# Altium schematic sheet 04_SODIMM connector 1_3.SchDoc: C200
size 594 x 420 mm; Page Create Date: March  8, 1995; Page Number: 4; Page Size: A2; Comment: radxa_1010; Page Count: 21; RevCode: V1.11; Doc: 04_SODIMM connector 1_3; DsnPath: D:\WMS\C200\CC122\对外\C200 V1.11.DSN; SchematicName: c200; PageName: 04_SODIMM connector 1_3; PageSize: A2; TopSchematic: True
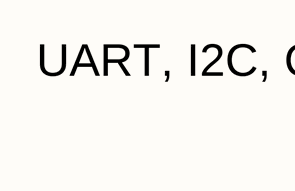
[diagram p0: 04_SODIMM connector 1_3.SchDoc, top left]
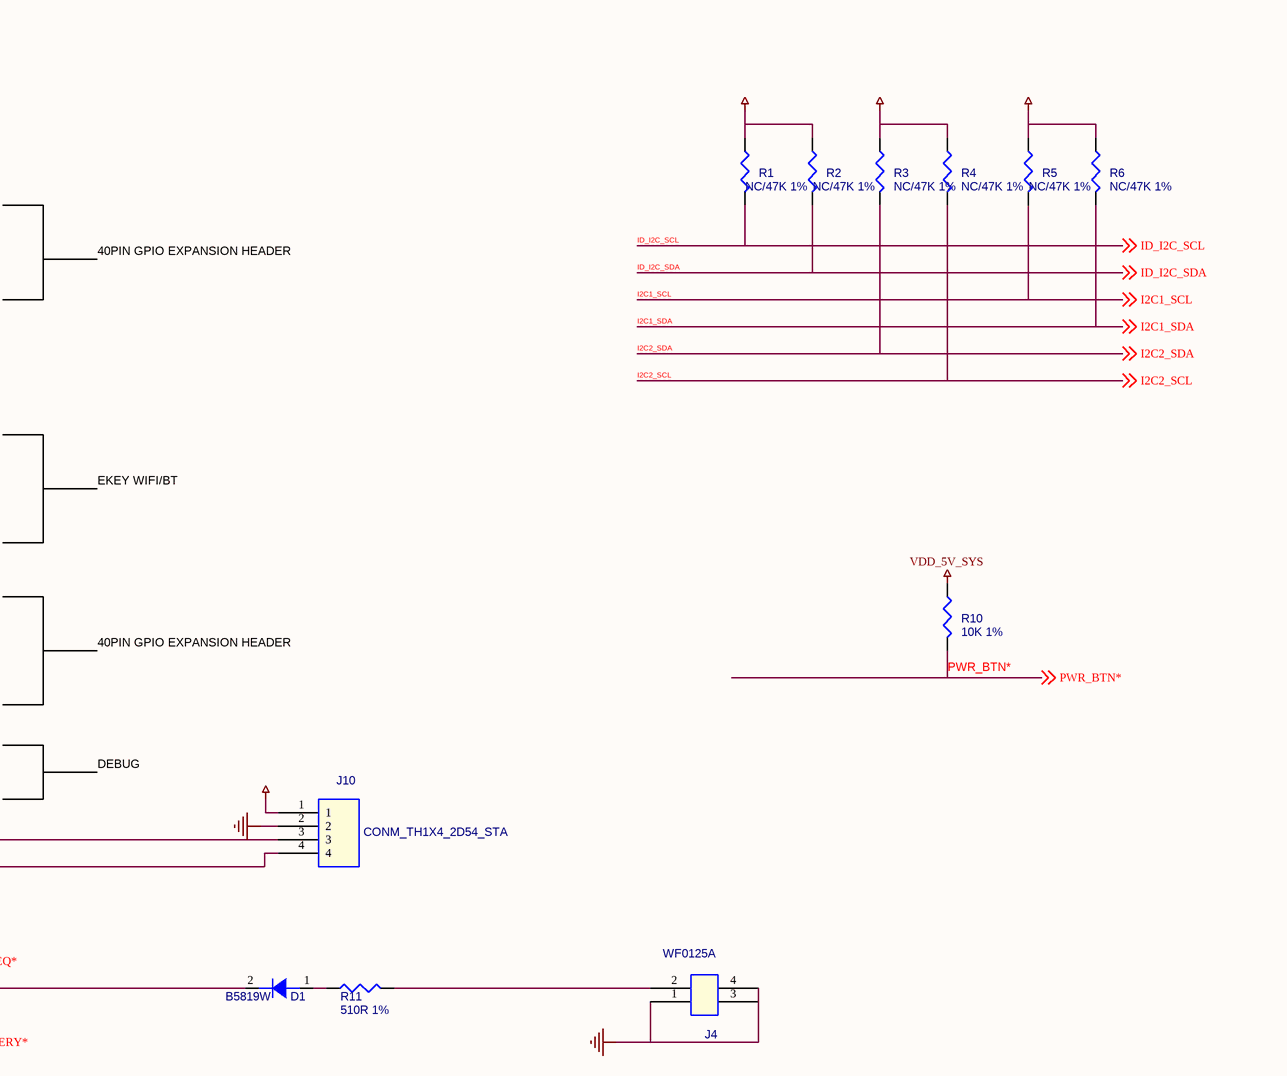
[diagram p1: 04_SODIMM connector 1_3.SchDoc, top right]
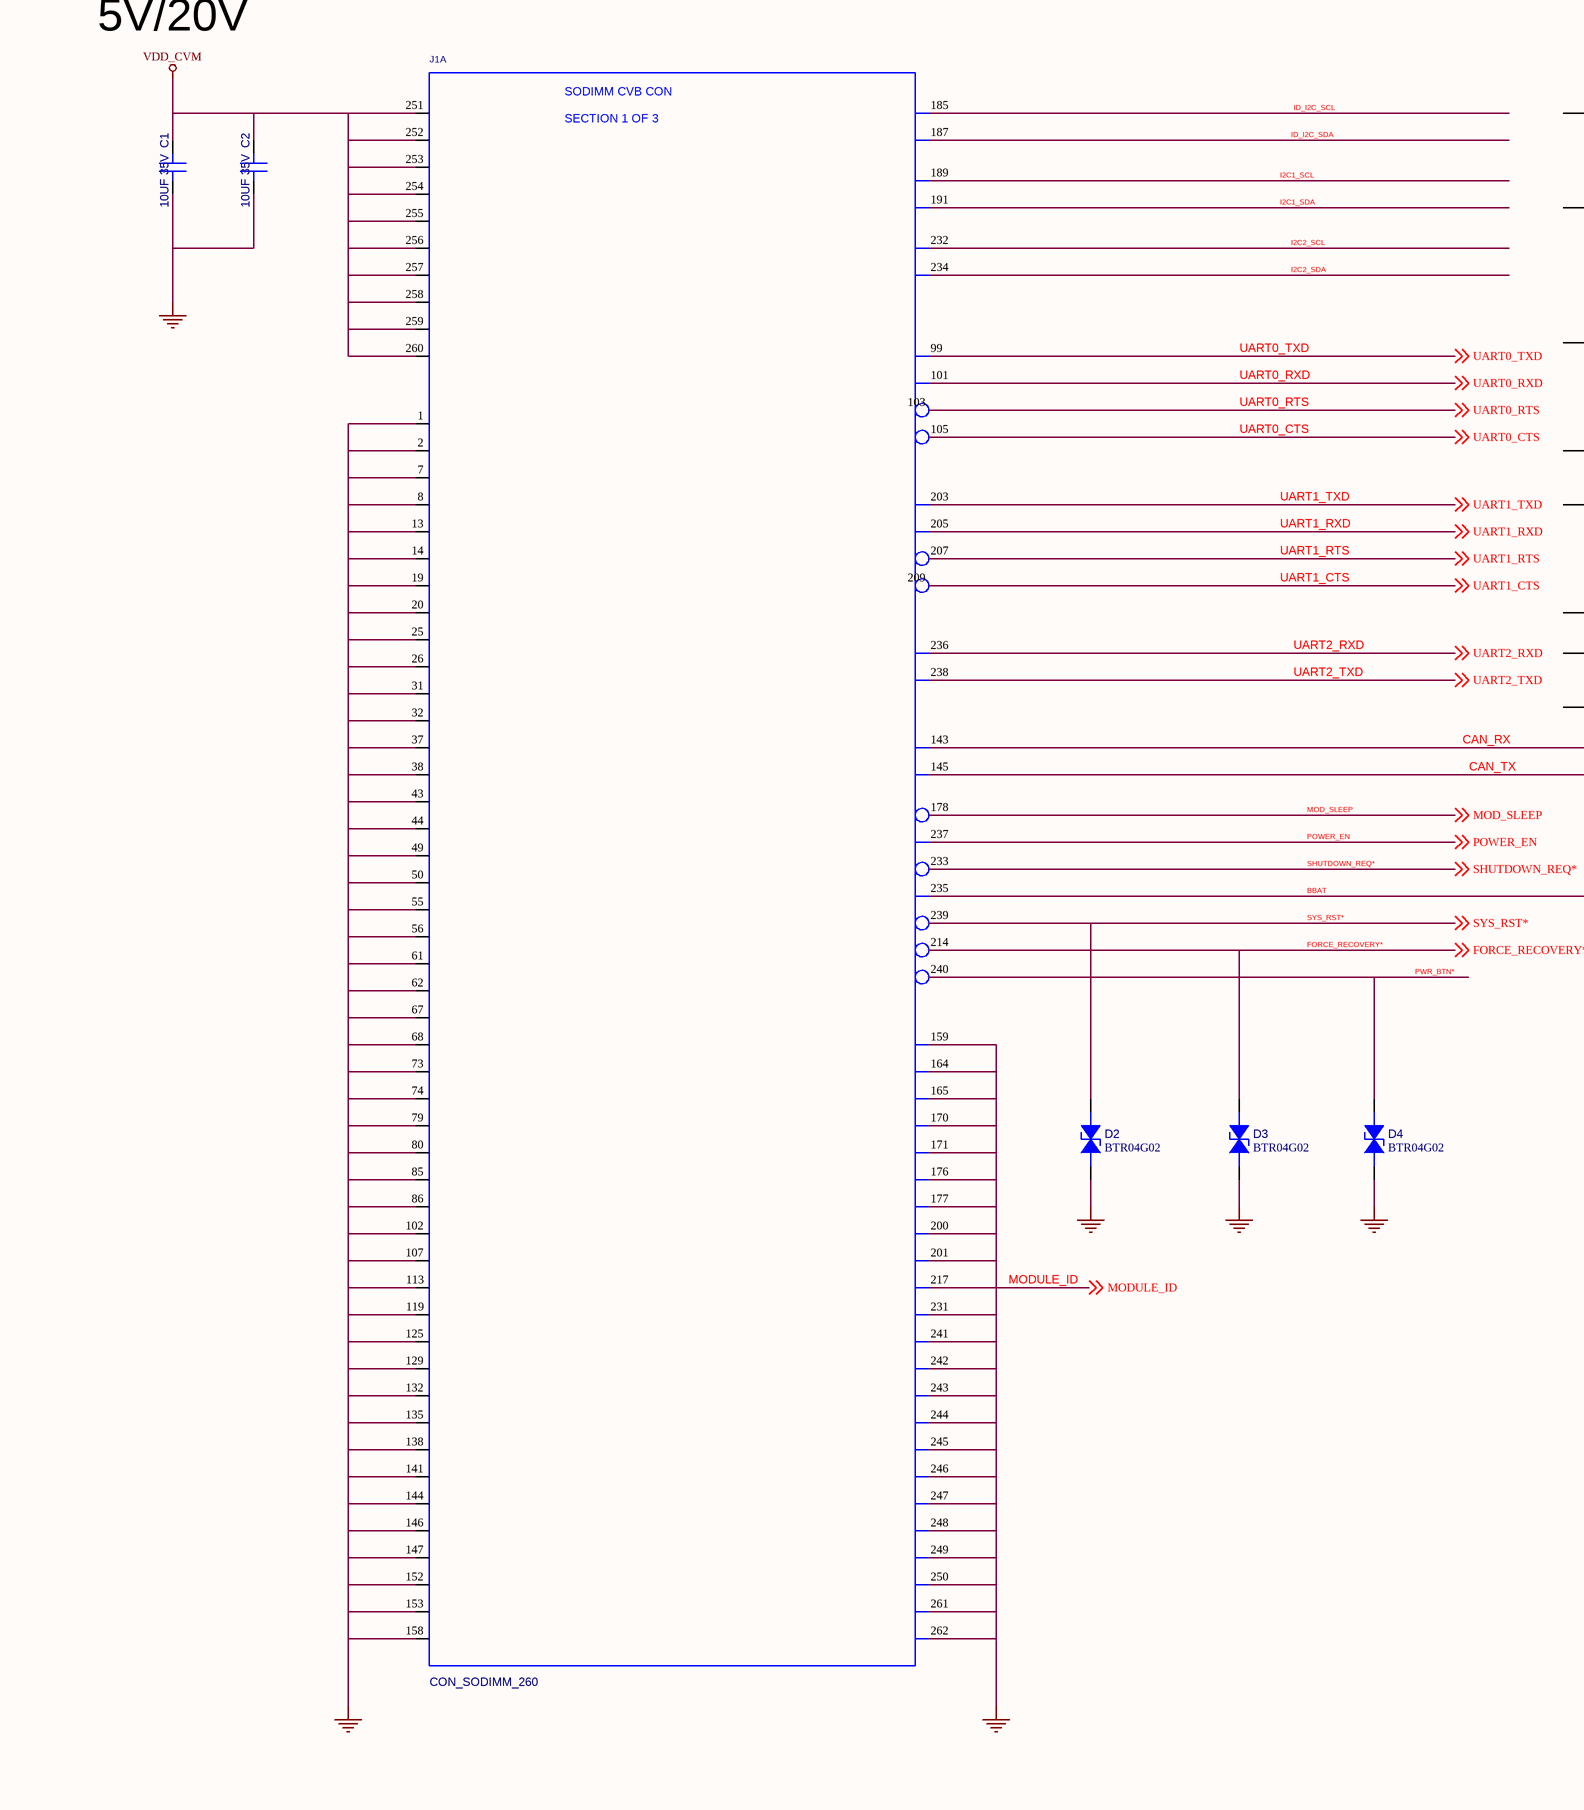
[diagram p2: 04_SODIMM connector 1_3.SchDoc, bottom left]
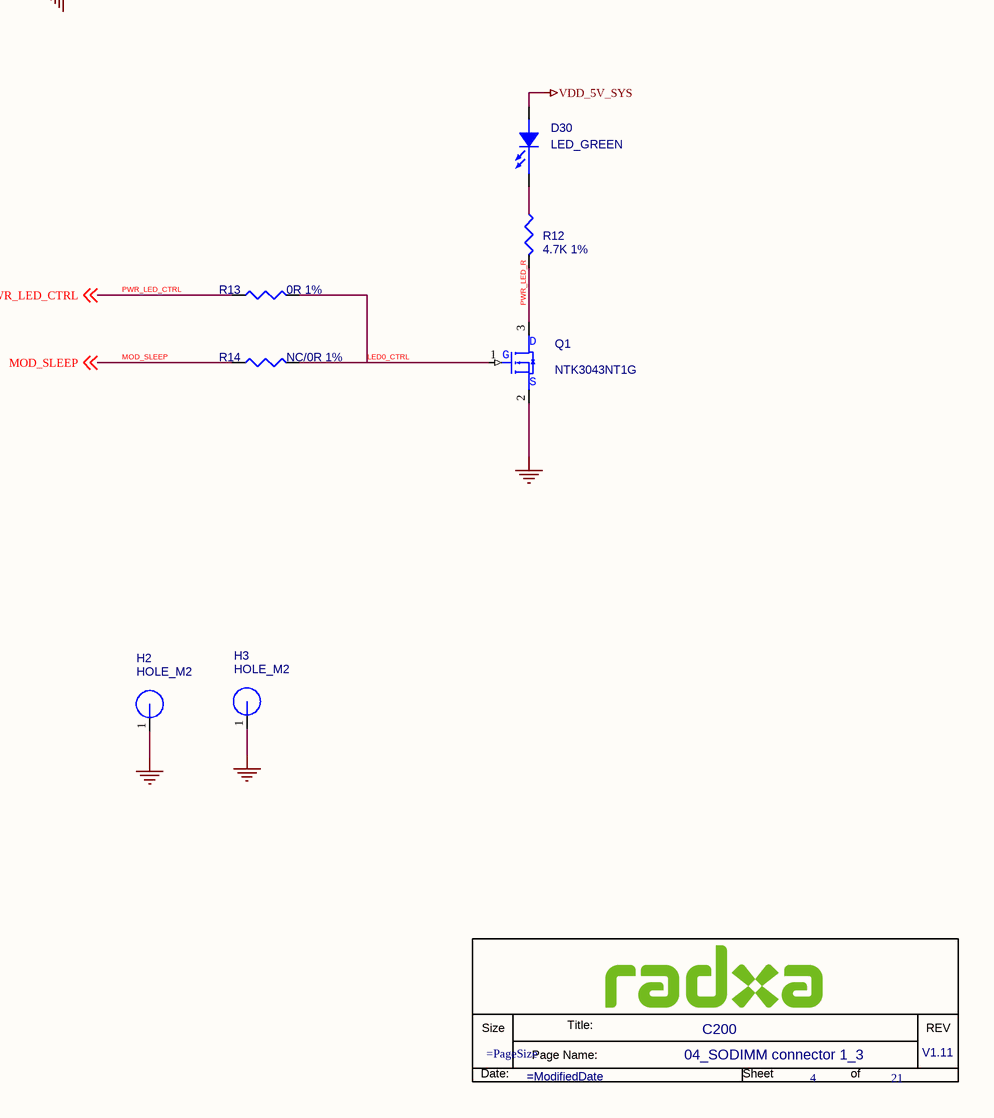
[diagram p3: 04_SODIMM connector 1_3.SchDoc, bottom right]

## Parts
*  Doc: 04_SODIMM connector 1_3  RevCode: V1.11  Title: C200  Page Number: 4  Page Count: 21  (hidden comment: radxa_1010)  (graphical)
C1  10UF 35V  [C1206]
C2  10UF 35V  [C1206]
D1  B5819W  [SOD_123]
D2  BTR04G02  [DFN1006-2L]
D3  BTR04G02  [DFN1006-2L]
D4  BTR04G02  [DFN1006-2L]
D30  LED_GREEN  [LED_D0603]
H2  HOLE_M2  [H3.8MM]
H3  HOLE_M2  [H3.8MM]
J1  CON_SODIMM_260  [SODIMM_SM260_0D5_78D0X26D1]  (part A of 3)
J4  WF0125A  [CON_SM1X2_1D25_LIE]
J10  CONM_TH1X4_2D54_STA  [CONM_TH1X4_2D54_STA]
Q1  NTK3043NT1G  [SOT_723]
R1  NC/47K 1%  [R0402]
R2  NC/47K 1%  [R0402]
R3  NC/47K 1%  [R0402]
R4  NC/47K 1%  [R0402]
R5  NC/47K 1%  [R0402]
R6  NC/47K 1%  [R0402]
R10  10K 1%  [R0402]
R11  510R 1%  [R0402]
R12  4.7K 1%  [R0402]
R13  0R 1%  [R0402]
R14  NC/0R 1%  [R0402]

## Nets
GND: C1.2(B) C2.2(B) D2.1(ANODE) D3.1(ANODE) D4.1(ANODE) H2.1 H3.1 J1.1(GND1) J1.2(GND2) J1.7(GND3) J1.8(GND4) J1.13(GND5) J1.14(GND6) J1.19(GND7) J1.20(GND8) J1.25(GND9) J1.26(GND10) J1.31(GND11) J1.32(GND12) J1.37(GND13) J1.38(GND14) J1.43(GND15) J1.44(GND16) J1.49(GND17) J1.50(GND18) J1.55(GND19) J1.56(GND20) J1.61(GND21) J1.62(GND22) J1.67(GND23) J1.68(GND24) J1.73(GND25) J1.74(GND26) J1.79(GND27) J1.80(GND28) J1.85(GND29) J1.86(GND30) J1.102(GND31) J1.107(GND32) J1.113(GND33) J1.119(GND34) J1.125(GND35) J1.129(GND36) J1.132(GND37) J1.135(GND38) J1.138(GND39) J1.141(GND40) J1.144(GND41) J1.146(GND42) J1.147(GND43) J1.152(GND44) J1.153(GND45) J1.158(GND46) J1.159(GND47) J1.164(GND48) J1.165(GND49) J1.170(GND50) J1.171(GND51) J1.176(GND52) J1.177(GND53) J1.200(GND54) J1.201(GND55) J1.231(GND57) J1.241(GND58) J1.242(GND59) J1.243(GND60) J1.244(GND61) J1.245(GND62) J1.246(GND63) J1.247(GND64) J1.248(GND65) J1.249(GND66) J1.250(GND67) J1.261(MNT1) J1.262(MNT2) J4.1 J4.3 J4.4 J10.2 Q1.2(S)
VDD_1V8: R3.1 R4.1
VDD_3V3_SYS: J10.1 R1.1 R2.1 R5.1 R6.1
VDD_5V_SYS: D30.1(ANODE) R10.1
VDD_CVM: C1.1(A) C2.1(A) J1.251(VDD_IN1) J1.252(VDD_IN2) J1.253(VDD_IN3) J1.254(VDD_IN4) J1.255(VDD_IN5) J1.256(VDD_IN6) J1.257(VDD_IN7) J1.258(VDD_IN8) J1.259(VDD_IN9) J1.260(VDD_IN10)
BBAT: D1.2(K) J1.235(PMIC_BBAT)
CAN_RX: J1.143(CAN_RX) J10.3
CAN_TX: J1.145(CAN_TX) J10.4
FORCE_RECOVERY*: D3.2(CATHODE) J1.214(FORCE_RECOVERY*) ; off-sheet FORCE_RECOVERY*
I2C1_SCL: J1.189(GEN2_I2C_SCL) R5.2 ; off-sheet I2C1_SCL
I2C1_SDA: J1.191(GEN2_I2C_SDA) R6.2 ; off-sheet I2C1_SDA
I2C2_SCL: J1.232(GEN3_I2C_SCL) R4.2 ; off-sheet I2C2_SCL
I2C2_SDA: J1.234(GEN3_I2C_SDA) R3.2 ; off-sheet I2C2_SDA
ID_I2C_SCL: J1.185(GEN1_I2C_SCL) R1.2 ; off-sheet ID_I2C_SCL
ID_I2C_SDA: J1.187(GEN1_I2C_SDA) R2.2 ; off-sheet ID_I2C_SDA
LED0_CTRL: Q1.1(G) R13.2 R14.2
MOD_SLEEP: J1.178(GPIO_PA6) R14.1 ; off-sheet MOD_SLEEP
MODULE_ID: J1.217(GND56) ; off-sheet MODULE_ID
POWER_EN: J1.237(POWER_EN) ; off-sheet POWER_EN
PWR_BTN*: D4.2(CATHODE) J1.240(BUTTON_PWR_ON*) R10.2 ; off-sheet PWR_BTN*
PWR_LED_CTRL: R13.1 ; off-sheet PWR_LED_CTRL
PWR_LED_R: Q1.3(D) R12.2
SHUTDOWN_REQ*: J1.233(SHUTDOWN_REQ*) ; off-sheet SHUTDOWN_REQ*
SYS_RST*: D2.2(CATHODE) J1.239(SYS_RESET_IN*) ; off-sheet SYS_RST*
UART0_CTS: J1.105(UART3_CTS) ; off-sheet UART0_CTS
UART0_RTS: J1.103(UART3_RTS) ; off-sheet UART0_RTS
UART0_RXD: J1.101(UART3_RXD) ; off-sheet UART0_RXD
UART0_TXD: J1.99(UART3_TXD) ; off-sheet UART0_TXD
UART1_CTS: J1.209(UART2_CTS) ; off-sheet UART1_CTS
UART1_RTS: J1.207(UART2_RTS) ; off-sheet UART1_RTS
UART1_RXD: J1.205(UART2_RXD) ; off-sheet UART1_RXD
UART1_TXD: J1.203(UART2_TXD) ; off-sheet UART1_TXD
UART2_RXD: J1.236(UART1_TXD) ; off-sheet UART2_RXD
UART2_TXD: J1.238(UART1_RXD) ; off-sheet UART2_TXD
NetD1_1: D1.1(A) R11.2
NetD30_2: D30.2 R12.1
NetJ4_2: J4.2 R11.1

## Notes on the sheet
- UART, I2C, CAN and GPIOs
- 5V/20V
- 40PIN GPIO EXPANSION HEADER
- EKEY WIFI/BT
- DEBUG
- (in symbol CON_SODIMM_260, part A) SODIMM CVB CON; SECTION 1 OF 3
- (in symbol radxa_1010) Title:; Size; REV; Page Name:; Date:; Sheet; of

## Library data of the parts
C1 = C: SMD  1206  10UF  35V  X5R  ±10%  ROHS; PARTS: 1; Part Reference: C1; Part Number: A1C01.00333; OriginalSymbolOrigin: (0,30); PKG_TYPE: CAP2-100-250; LEVEL: STD; PINSWAP: (A,B); Value: 10UF 35V; Part Type: 陶瓷电容; PCB Footprint: C1206
C2 = C: SMD  1206  10UF  35V  X5R  ±10%  ROHS; PARTS: 1; Part Reference: C2; Part Number: A1C01.00333; OriginalSymbolOrigin: (0,30); PKG_TYPE: CAP2-100-250; LEVEL: STD; PINSWAP: (A,B); Value: 10UF 35V; Part Type: 陶瓷电容; PCB Footprint: C1206
D1 = DIODE: SMD  编带  SOD-123  B5819W  长电  ROHS; Part Reference: D1; Part Number: A1D02.00010; Manufacturer PN: SS32; Manufacturer: 星海; Priority: A; PCB Footprint: SOD_123; Value: B5819W; Created by: JJJ; Part Type: 二极管-ESD管-桥堆-TVS管; RK PN: SS32
D2 = ESD: SMD  编带  0402  BTR04G02  B-tron  ROHS; Part Reference: D2; Part Number: A1D02.00002; Parameter: ESD-台舟 ESD5341N-封装 esd0402; ID: DE-E0004; Temp Coeff: -50℃ ~ +125℃; PCB Footprint: ESD_D0402; Value: BTR04G02; Part Type: 二极管-ESD管-桥堆-TVS管
D3 = ESD: SMD  编带  0402  BTR04G02  B-tron  ROHS; Part Reference: D3; Part Number: A1D02.00002; Parameter: ESD-台舟 ESD5341N-封装 esd0402; ID: DE-E0004; Temp Coeff: -50℃ ~ +125℃; PCB Footprint: ESD_D0402; Value: BTR04G02; Part Type: 二极管-ESD管-桥堆-TVS管
D4 = ESD: SMD  编带  0402  BTR04G02  B-tron  ROHS; Part Reference: D4; Part Number: A1D02.00002; Parameter: ESD-台舟 ESD5341N-封装 esd0402; ID: DE-E0004; Temp Coeff: -50℃ ~ +125℃; PCB Footprint: ESD_D0402; Value: BTR04G02; Part Type: 二极管-ESD管-桥堆-TVS管
D30 = LED: SMD  编带  0603  发绿光  单色  mcd=150  IF=20mA  无色散光  EY-TB0603GC-010F  恩域光电  ROHS; Part Reference: D30; Part Number: A1D03.00002; Temp Coeff: -40℃ to +85℃; Value: LED_GREEN; Part Type: 发光二极管; PCB Footprint: LED_D0603
H2 = HOLE: Part Reference: H2; PCB Footprint: HOLE_2D7_6D0_A; RK PN: HOLE_3R50; Priority: A; Value: HOLE_M2; Part Type: HOLE
H3 = HOLE: Part Reference: H3; PCB Footprint: HOLE_2D7_6D0_A; RK PN: HOLE_3R50; Priority: A; Value: HOLE_M2; Part Type: HOLE
J1 = CON_SODIMM_260: SMD  母座  立贴  0.5mm脚距  AS0AA826-EASB0-7H  Foxconn  ROHS; Part Reference: J1; Part Number: A1J01.00015; OriginalSymbolOrigin: (-950,2300); ANGLE: ?; ASSEMBLY: ?; EMI_GROUND_TAB: ?; GENDER: ?; LATCHING: ?; MAX_CURRENT: ?; MAX_VOLTAGE: ?; NV_NAME: ?; NV_PN: ?; PACK_TYPE: ?; PATH: ?; PITCH: ?; PLACEMENT_NOTE: ?; REFLOW: ?; SHIELDED: ?; SHROUDED: ?; SKU: COMMON; Value: CON_SODIMM_260; Part Type: 连接座; PCB Footprint: SODIMM_SM260_0D5_78D0X26D1
J4 = CON1X2: SMD  母座  1*2PIN  180度  卧贴  1.25mm脚距  耐高温  5001—C—2R1-00  米黄色  文章济美  ROHS; Part Reference: J4; Part Number: A1J01.00027; Value: WF0125A; Part Type: 连接座; PCB Footprint: CON_SM1X2_1D25_LIE
J10 = CONM_TH1X4_2D54_STA: Part Reference: J10; Value: CONM_TH1X4_2D54_STA; PCB Footprint: CONM_TH1X4_2D54_STA
Q1 = MOSFET_NPN: SMD  编带  SOT-723  NTK3043NT1G  N沟道  ON  ROHS; Part Reference: Q1; Part Number: A1D01.00069; Temp Coeff: -55℃ to ＋150℃; Value: NTK3043NT1G; Part Type: 三极管-MOS管; PCB Footprint: SOT_723
R1 = R: SMD  0402  47K  1/16W  ±1%  ROHS; Part Reference: R1; Part Number: A1R01.00248; CDS_PART_NAME: R_0402-47K,5 %,62.5MW,195-0599-000; CDS_PHYS_PART_NAME: R_0402-47K,5 %,62.5MW,195-0599-000-195-0599-000,47K; ASSEMBLY: CVB_CONN; CDS_LIB: discrete; CDS_SEC: 1; DEVICE_TYPENAME: R_0402-47K5625MW195-0599-000-195-0599-00047K; DRAWING: @P3449_B01_LIB.P3449_B01(SCH_1):PAGE4; LOCATION: R63; MAX_WATTAGE: 62.5mW; NV_PN: 195-0599-000; PACK_TYPE: 402; PATH: I62; PHYS_PAGE: 4; ROT: 0; SIGNAL_MODEL: nv_res; TOL: 5%; VER: 2; XY: (-2450,6850); PCB Footprint: R0402; Value: NC/47K 1%; Part Type: 贴片电阻; CHIPS_PART_NAME: R; SEC: 1; SKU: NO STUFF
R2 = R: SMD  0402  47K  1/16W  ±1%  ROHS; Part Reference: R2; Part Number: A1R01.00248; CDS_PART_NAME: R_0402-47K,5 %,62.5MW,195-0599-000; CDS_PHYS_PART_NAME: R_0402-47K,5 %,62.5MW,195-0599-000-195-0599-000,47K; ASSEMBLY: CVB_CONN; CDS_LIB: discrete; CDS_SEC: 1; DEVICE_TYPENAME: R_0402-47K5625MW195-0599-000-195-0599-00047K; DRAWING: @P3449_B01_LIB.P3449_B01(SCH_1):PAGE4; LOCATION: R64; MAX_WATTAGE: 62.5mW; NV_PN: 195-0599-000; PACK_TYPE: 402; PATH: I63; PHYS_PAGE: 4; ROT: 0; SIGNAL_MODEL: nv_res; TOL: 5%; VER: 2; XY: (-2200,6850); PCB Footprint: R0402; Value: NC/47K 1%; Part Type: 贴片电阻; CHIPS_PART_NAME: R; SEC: 1; SKU: NO STUFF
R3 = R: SMD  0402  47K  1/16W  ±1%  ROHS; Part Reference: R3; Part Number: A1R01.00248; CDS_PART_NAME: R_0402-47K,5 %,62.5MW,195-0599-000; CDS_PHYS_PART_NAME: R_0402-47K,5 %,62.5MW,195-0599-000-195-0599-000,47K; ASSEMBLY: CVB_CONN; CDS_LIB: discrete; CDS_SEC: 1; DEVICE_TYPENAME: R_0402-47K5625MW195-0599-000-195-0599-00047K; DRAWING: @P3449_B01_LIB.P3449_B01(SCH_1):PAGE4; LOCATION: R65; MAX_WATTAGE: 62.5mW; NV_PN: 195-0599-000; PACK_TYPE: 402; PATH: I64; PHYS_PAGE: 4; ROT: 0; SIGNAL_MODEL: nv_res; TOL: 5%; VER: 2; XY: (-1950,6850); PCB Footprint: R0402; Value: NC/47K 1%; Part Type: 贴片电阻; CHIPS_PART_NAME: R; SEC: 1; SKU: NO STUFF
R4 = R: SMD  0402  47K  1/16W  ±1%  ROHS; Part Reference: R4; Part Number: A1R01.00248; CDS_PART_NAME: R_0402-47K,5 %,62.5MW,195-0599-000; CDS_PHYS_PART_NAME: R_0402-47K,5 %,62.5MW,195-0599-000-195-0599-000,47K; ASSEMBLY: CVB_CONN; CDS_LIB: discrete; CDS_SEC: 1; DEVICE_TYPENAME: R_0402-47K5625MW195-0599-000-195-0599-00047K; DRAWING: @P3449_B01_LIB.P3449_B01(SCH_1):PAGE4; LOCATION: R66; MAX_WATTAGE: 62.5mW; NV_PN: 195-0599-000; PACK_TYPE: 402; PATH: I65; PHYS_PAGE: 4; ROT: 0; SIGNAL_MODEL: nv_res; TOL: 5%; VER: 2; XY: (-1700,6850); PCB Footprint: R0402; Value: NC/47K 1%; Part Type: 贴片电阻; CHIPS_PART_NAME: R; SEC: 1; SKU: NO STUFF
R5 = R: SMD  0402  47K  1/16W  ±1%  ROHS; Part Reference: R5; Part Number: A1R01.00248; CDS_PART_NAME: R_0402-47K,5 %,62.5MW,195-0599-000; CDS_PHYS_PART_NAME: R_0402-47K,5 %,62.5MW,195-0599-000-195-0599-000,47K; ASSEMBLY: CVB_CONN; CDS_LIB: discrete; CDS_SEC: 1; DEVICE_TYPENAME: R_0402-47K5625MW195-0599-000-195-0599-00047K; DRAWING: @P3449_B01_LIB.P3449_B01(SCH_1):PAGE4; LOCATION: R67; MAX_WATTAGE: 62.5mW; NV_PN: 195-0599-000; PACK_TYPE: 402; PATH: I66; PHYS_PAGE: 4; ROT: 0; SIGNAL_MODEL: nv_res; TOL: 5%; VER: 2; XY: (-1400,6850); PCB Footprint: R0402; Value: NC/47K 1%; Part Type: 贴片电阻; CHIPS_PART_NAME: R; SEC: 1; SKU: NO STUFF
R6 = R: SMD  0402  47K  1/16W  ±1%  ROHS; Part Reference: R6; Part Number: A1R01.00248; CDS_PART_NAME: R_0402-47K,5 %,62.5MW,195-0599-000; CDS_PHYS_PART_NAME: R_0402-47K,5 %,62.5MW,195-0599-000-195-0599-000,47K; ASSEMBLY: CVB_CONN; CDS_LIB: discrete; CDS_SEC: 1; DEVICE_TYPENAME: R_0402-47K5625MW195-0599-000-195-0599-00047K; DRAWING: @P3449_B01_LIB.P3449_B01(SCH_1):PAGE4; LOCATION: R68; MAX_WATTAGE: 62.5mW; NV_PN: 195-0599-000; PACK_TYPE: 402; PATH: I67; PHYS_PAGE: 4; ROT: 0; SIGNAL_MODEL: nv_res; TOL: 5%; VER: 2; XY: (-1150,6850); PCB Footprint: R0402; Value: NC/47K 1%; Part Type: 贴片电阻; CHIPS_PART_NAME: R; SEC: 1; SKU: NO STUFF
R10 = R: SMD  0402  10K  1/16W  ±1%  ROHS; Part Reference: R10; Part Number: A1R01.00222; CDS_PHYS_PART_NAME: R_0402-10K,5 %,62.5MW,195-0486-000-10K,195-0486-000; CDS_PART_NAME: R_0402-10K,5 %,62.5MW,195-0486-000; SEC: 1; XY: (-1400,3900); VER: 2; TOL: 5%; SIGNAL_MODEL: nv_res; ROT: 0; PHYS_PAGE: 4; PATH: I76; PACK_TYPE: 402; NV_PN: 195-0486-000; MAX_WATTAGE: 62.5mW; LOCATION: R164; DRAWING: @P3449_B01_LIB.P3449_B01(SCH_1):PAGE4; DEVICE_TYPENAME: R_0402-10K5625MW195-0486-000-10K195-0486-000; CDS_LIB: discrete; ASSEMBLY: CVB_CONN; PCB Footprint: R0402; Value: 10K 1%; Part Type: 贴片电阻; CHIPS_PART_NAME: R; CDS_SEC: 1
R11 = R: SMD  0402  510R  1/16W  ±1%  ROHS; Part Reference: R11; Part Number: A1R01.00312; PCB Footprint: R0402; Value: 510R 1%; Part Type: 贴片电阻
R12 = R: SMD  0402  4.7K  1/16W  ±1%  ROHS; Part Reference: R12; Part Number: A1R01.00250; CDS_PHYS_PART_NAME: R_0402-1.8K,5 %,62.5MW,195-0528-000-1.8K,195-0528-000; CDS_PART_NAME: R_0402-1.8K,5 %,62.5MW,195-0528-000; SEC: 1; XY: (-1550,2000); VER: 2; TOL: 5%; SIGNAL_MODEL: nv_res; ROT: 0; PHYS_PAGE: 4; PATH: I94; PACK_TYPE: 402; NV_PN: 195-0528-000; MAX_WATTAGE: 62.5mW; LOCATION: R297; DRAWING: @P3449_B01_LIB.P3449_B01(SCH_1):PAGE4; DEVICE_TYPENAME: R_0402-18K5625MW195-0528-000-18K195-0528-000; CDS_LIB: discrete; ASSEMBLY: POWER_LED; PCB Footprint: R0402; Value: 4.7K 1%; Part Type: 贴片电阻; CHIPS_PART_NAME: R; CDS_SEC: 1
R13 = R: SMD  0402  0R  1/16W  ±1%  ROHS; Part Reference: R13; Part Number: A1R01.00219; PCB Footprint: R0402; Value: 0R 1%; Part Type: 贴片电阻
R14 = R: SMD  0402  0R  1/16W  ±1%  ROHS; Part Reference: R14; Part Number: A1R01.00219; PCB Footprint: R0402; Value: NC/0R 1%; Part Type: 贴片电阻
* = radxa_1010: Page Create Date: March  8, 1995; Page Size: =PageSize; Page Modify Date: =ModifiedDate